# Altium schematic sheet PowerSupply.SchDoc: **
size A4; Author: **; CompanyName: Introducción al Diseño de Circuitos Impresos; Organization: UTN FRBA; Revision: **
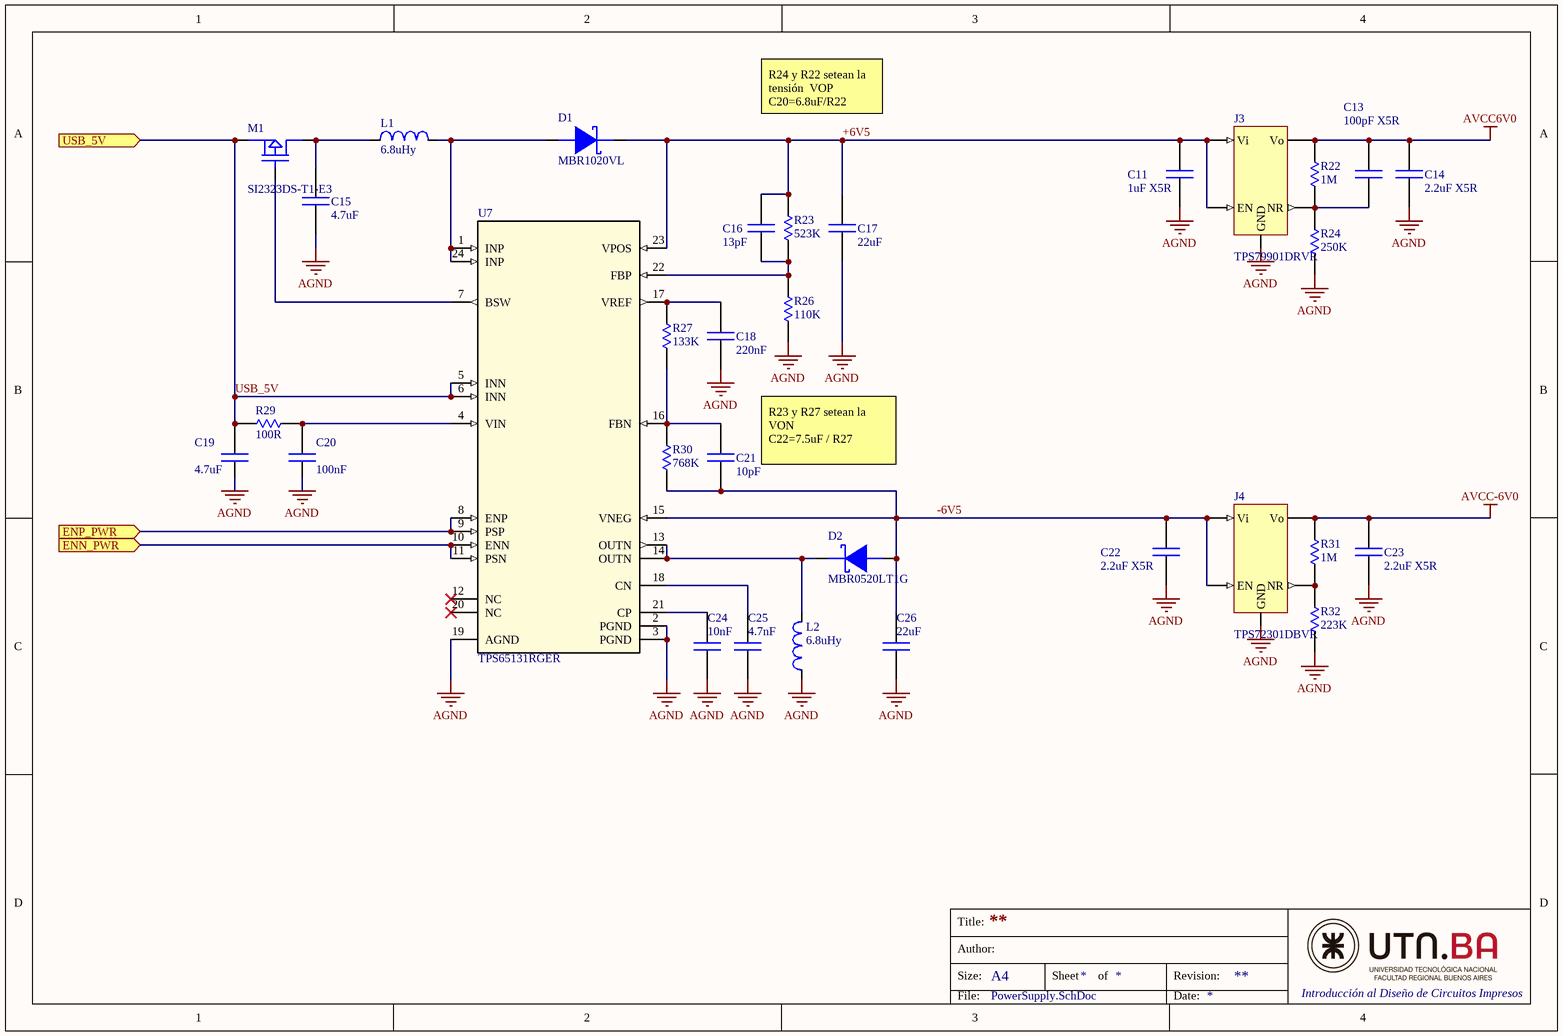
[diagram p0: PowerSupply.SchDoc]

## Parts
C11  1uF X5R  [C_0805]
C13  100pF X5R  [C_0805]
C14  2.2uF X5R  [C_0805]
C15  4.7uF  [C_0805]
C16  13pF  [C_0603]
C17  22uF  [C_1206]
C18  220nF  [C_0603]
C19  4.7uF  [C_0805]
C20  100nF  [C_0603]
C21  10pF  [C_0603]
C22  2.2uF X5R  [C_0805]
C23  2.2uF X5R  [C_0805]
C24  10nF  [C_0603]
C25  4.7nF  [C_0603]
C26  22uF  [C_1206]
D1  MBR1020VL  [SOD-123]
D2  MBR0520LT1G  [SOD-123]
J3  TPS79901DRVR  [WSON]
J4  TPS72301DBVR  [SOT_23]
L1  6.8uHy  [L_4028]
L2  6.8uHy  [L_4028]
M1  SI2323DS-T1-E3  [SOT_23_Q]
R22  1M  [R_0603]
R23  523K  [R_0603]
R24  250K  [R_0603]
R26  110K  [R_0603]
R27  133K  [R_0603]
R29  100R  [R_0603]
R30  768K  [R_0603]
R31  1M  [R_0603]
R32  223K  [R_0603]
U7  TPS65131RGER  [VQFN-N24]

## Ports
ENN_PWR (in), ENP_PWR (in), USB_5V (in)

## Nets
AGND: C11.2 C14.2 C15.2 C17.1 C18.2 C19.2 C20.2 C22.2 C23.2 C24.2 C25.2 C26.2 J3.2(GND) J4.2(GND) L2.1 R24.1 R26.2 R32.1 U7.2(PGND) U7.3(PGND) U7.19(AGND)
AVCC6V0: C13.1 C14.1 J3.5(Vo) R22.2
AVCC-6V0: C23.1 J4.5(Vo) R31.2
+6V5: C11.1 C16.2 C17.2 D1.1(K) J3.1(Vi) J3.3(EN) R23.1 U7.23(VPOS)
-6V5: C21.1 C22.1 C26.1 D2.2(A) J4.1(Vi) J4.3(EN) R30.2 U7.15(VNEG)
ENN_PWR: U7.10(ENN) U7.11(PSN) ; port ENN_PWR
ENP_PWR: U7.8(ENP) U7.9(PSP) ; port ENP_PWR
USB_5V: C19.1 M1.2(Source) R29.1 U7.5(INN) U7.6(INN) ; port USB_5V
NetC13_2: C13.2 J3.4(NR) R22.1 R24.2
NetC15_1: C15.1 L1.1 M1.3(Drain)
NetC16_1: C16.1 R23.2 R26.1 U7.22(FBP)
NetC18_1: C18.1 R27.2 U7.17(VREF)
NetC20_1: C20.1 R29.2 U7.4(VIN)
NetC21_2: C21.2 R27.1 R30.1 U7.16(FBN)
NetC24_1: C24.1 U7.21(CP)
NetC25_1: C25.1 U7.18(CN)
NetD1_2: D1.2(A) L1.2 U7.1(INP) U7.24(INP)
NetD2_1: D2.1(K) L2.2 U7.13(OUTN) U7.14(OUTN)
NetJ4_4: J4.4(NR) R31.1 R32.2
NetM1_1: M1.1(Gate) U7.7(BSW)

Not connected (* = marked no-connect by the designer): U7 12(NC)* 20(NC)*

## Notes on the sheet
- R24 y R22 setean la tensión  VOP
  C20=6.8uF/R22
- (near C21) R23 y R27 setean la VON
  C22=7.5uF / R27
- Title:
- Size:
- Author:
- A4
- Sheet
- of
- Revision:
- File:
- Date:

## Library data of the parts
C11 C13-C26 = Cap: Capacitor
D1 D2 = Diode: Schottky diode; Value: 385mV
J3 J4 = LDO: LDO_Adjustable
L1 L2 = Ind: Inductor
M1 = PMOS: Transistor
R22-R24 R26 R27 R29-R32 = Res: Resistor
U7 = TPS65131RGER: Positive and Negative Output DC-DC Converter; Application_BuildNumber: *